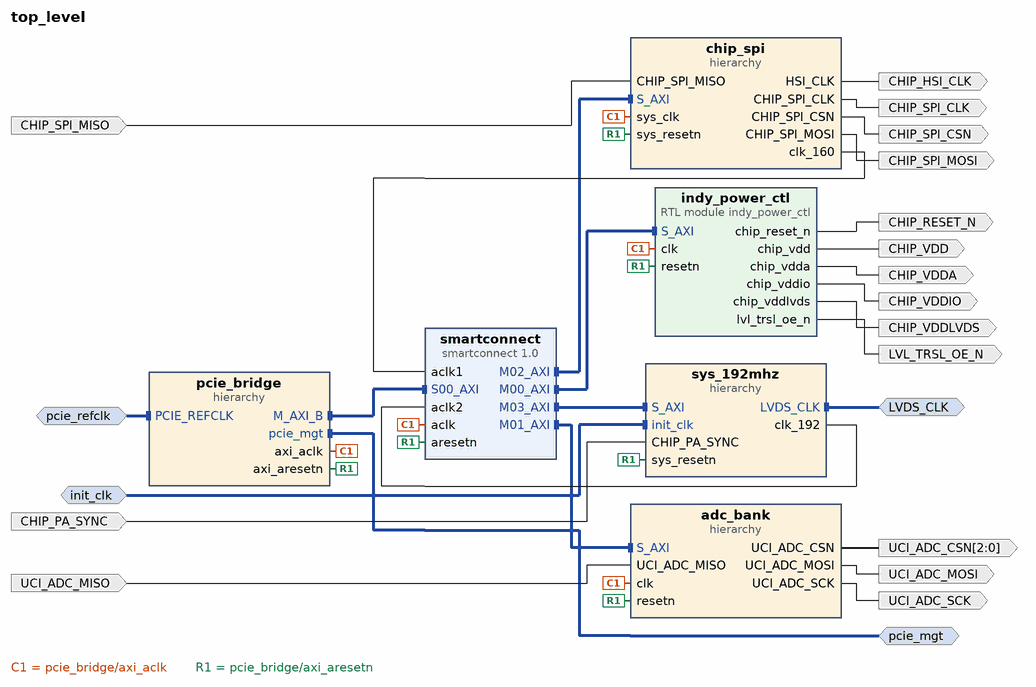
[diagram p0: block diagram of the top level]
# Vivado block design top_level, xcku15p-ffve1517-3-e, Vivado 2024.2
create_bd_design top_level

create_bd_intf_port -mode Slave -vlnv xilinx.com:interface:diff_clock_rtl:1.0 pcie_refclk
create_bd_intf_port -mode Master -vlnv xilinx.com:interface:pcie_7x_mgt_rtl:1.0 pcie_mgt
create_bd_intf_port -mode Slave -vlnv xilinx.com:interface:diff_clock_rtl:1.0 init_clk
set_property -dict {CONFIG.FREQ_HZ 200000000} [get_bd_intf_ports init_clk]
create_bd_intf_port -mode Master -vlnv xilinx.com:interface:diff_clock_rtl:1.0 LVDS_CLK
create_bd_port -dir O CHIP_SPI_CLK
create_bd_port -dir O CHIP_SPI_CSN
create_bd_port -dir O CHIP_SPI_MOSI
create_bd_port -dir I CHIP_SPI_MISO
create_bd_port -dir O CHIP_VDDIO
create_bd_port -dir O CHIP_VDD
create_bd_port -dir O CHIP_VDDLVDS
create_bd_port -dir O CHIP_VDDA
create_bd_port -dir O CHIP_RESET_N
create_bd_port -dir O -from 2 -to 0 UCI_ADC_CSN
create_bd_port -dir O UCI_ADC_SCK
create_bd_port -dir O UCI_ADC_MOSI
create_bd_port -dir I UCI_ADC_MISO
create_bd_port -dir O LVL_TRSL_OE_N
create_bd_port -dir O CHIP_HSI_CLK
create_bd_port -dir I CHIP_PA_SYNC

create_bd_cell -type hier pcie_bridge
create_bd_cell -type ip -vlnv xilinx.com:ip:smartconnect:1.0 smartconnect
set_property -dict {CONFIG.NUM_CLKS 3 CONFIG.NUM_MI 4 CONFIG.NUM_SI 1} [get_bd_cells smartconnect]
create_bd_cell -type hier adc_bank
create_bd_cell -type hier chip_spi
create_bd_cell -type module -reference indy_power_ctl indy_power_ctl
create_bd_cell -type hier sys_192mhz

# ---- hierarchy /pcie_bridge ----
current_bd_instance /pcie_bridge
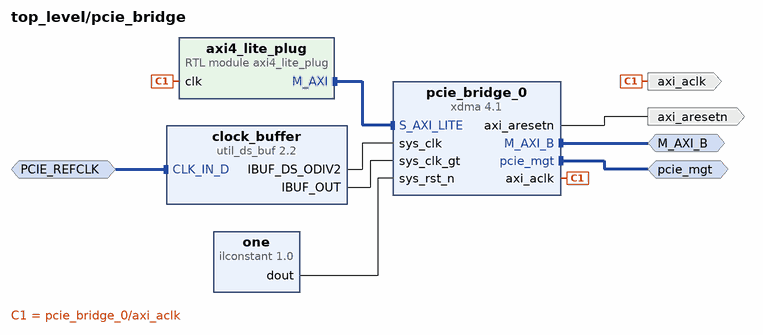
[diagram p1: block diagram inside /pcie_bridge]
create_bd_intf_pin -mode Slave -vlnv xilinx.com:interface:diff_clock_rtl:1.0 PCIE_REFCLK
create_bd_intf_pin -mode Master -vlnv xilinx.com:interface:pcie_7x_mgt_rtl:1.0 pcie_mgt
create_bd_intf_pin -mode Master -vlnv xilinx.com:interface:aximm_rtl:1.0 M_AXI_B
create_bd_pin -dir O -type clk axi_aclk
create_bd_pin -dir O -type rst axi_aresetn

create_bd_cell -type ip -vlnv xilinx.com:ip:util_ds_buf:2.2 clock_buffer
set_property -dict {CONFIG.C_BUF_TYPE IBUFDSGTE} [get_bd_cells clock_buffer]
create_bd_cell -type module -reference axi4_lite_plug axi4_lite_plug
create_bd_cell -type ip -vlnv xilinx.com:ip:xdma:4.1 pcie_bridge_0
set_property -dict [list \
  CONFIG.PF0_DEVICE_ID_mqdma 903F \
  CONFIG.PF0_SRIOV_VF_DEVICE_ID A03F \
  CONFIG.PF2_DEVICE_ID_mqdma 923F \
  CONFIG.PF3_DEVICE_ID_mqdma 933F \
  CONFIG.axi_addr_width 64 \
  CONFIG.axi_data_width 512_bit \
  CONFIG.axisten_freq 250 \
  CONFIG.bridge_burst true \
  CONFIG.en_axi_slave_if false \
  CONFIG.en_gt_selection false \
  CONFIG.functional_mode AXI_Bridge \
  CONFIG.mode_selection Advanced \
  CONFIG.pcie_blk_locn X0Y3 \
  CONFIG.pf0_bar0_scale Megabytes \
  CONFIG.pf0_bar0_size 1 \
  CONFIG.pf0_device_id 903F \
  CONFIG.pf0_msi_enabled false \
  CONFIG.pl_link_cap_max_link_speed 8.0_GT/s \
  CONFIG.pl_link_cap_max_link_width X16 \
  CONFIG.runbit_fix false \
  CONFIG.xlnx_ref_board None \
] [get_bd_cells pcie_bridge_0]
create_bd_cell -type inline_hdl -vlnv xilinx.com:inline_hdl:ilconstant:1.0 one

# ---- hierarchy /adc_bank ----
current_bd_instance /adc_bank
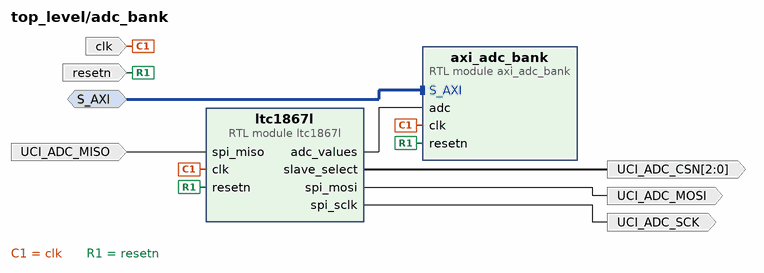
[diagram p2: block diagram inside /adc_bank]
create_bd_intf_pin -mode Slave -vlnv xilinx.com:interface:aximm_rtl:1.0 S_AXI
create_bd_pin -dir I -type clk clk
create_bd_pin -dir I -type rst resetn
create_bd_pin -dir O -from 2 -to 0 UCI_ADC_CSN
create_bd_pin -dir O UCI_ADC_SCK
create_bd_pin -dir O UCI_ADC_MOSI
create_bd_pin -dir I UCI_ADC_MISO

create_bd_cell -type module -reference axi_adc_bank axi_adc_bank
set_property -dict {CONFIG.ADC_COUNT 3} [get_bd_cells axi_adc_bank]
create_bd_cell -type module -reference ltc1867l ltc1867l
set_property -dict {CONFIG.ADC_COUNT 3} [get_bd_cells ltc1867l]

# ---- hierarchy /chip_spi ----
current_bd_instance /chip_spi
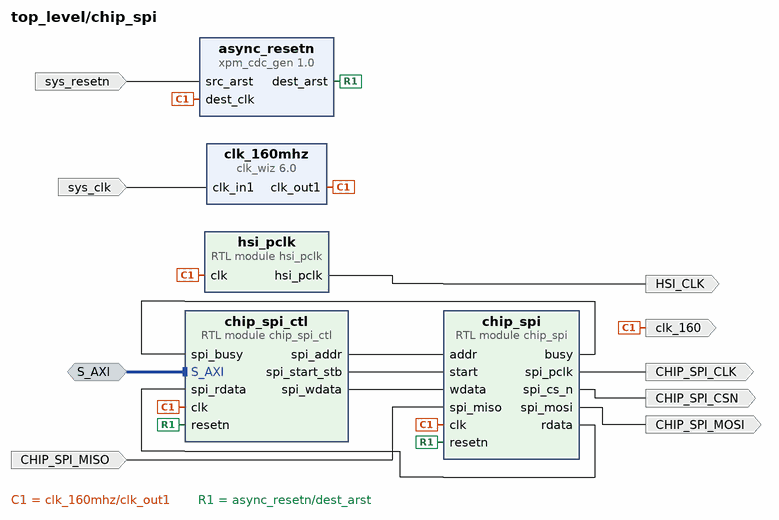
[diagram p3: block diagram inside /chip_spi]
create_bd_intf_pin -mode Slave -vlnv xilinx.com:interface:aximm_rtl:1.0 S_AXI
create_bd_pin -dir O CHIP_SPI_CLK
create_bd_pin -dir O CHIP_SPI_MOSI
create_bd_pin -dir I CHIP_SPI_MISO
create_bd_pin -dir O CHIP_SPI_CSN
create_bd_pin -dir O HSI_CLK
create_bd_pin -dir I sys_resetn
create_bd_pin -dir I -type clk sys_clk
create_bd_pin -dir O -type clk clk_160

create_bd_cell -type module -reference chip_spi chip_spi
create_bd_cell -type module -reference chip_spi_ctl chip_spi_ctl
create_bd_cell -type module -reference hsi_pclk hsi_pclk
create_bd_cell -type ip -vlnv xilinx.com:ip:clk_wiz:6.0 clk_160mhz
set_property -dict [list \
  CONFIG.CLKOUT1_JITTER 124.025 \
  CONFIG.CLKOUT1_REQUESTED_OUT_FREQ 160.00 \
  CONFIG.MMCM_CLKOUT0_DIVIDE_F 7.500 \
  CONFIG.USE_LOCKED false \
  CONFIG.USE_RESET false \
] [get_bd_cells clk_160mhz]
create_bd_cell -type ip -vlnv xilinx.com:ip:xpm_cdc_gen:1.0 async_resetn
set_property -dict {CONFIG.CDC_TYPE xpm_cdc_async_rst} [get_bd_cells async_resetn]

# ---- hierarchy /sys_192mhz ----
current_bd_instance /sys_192mhz
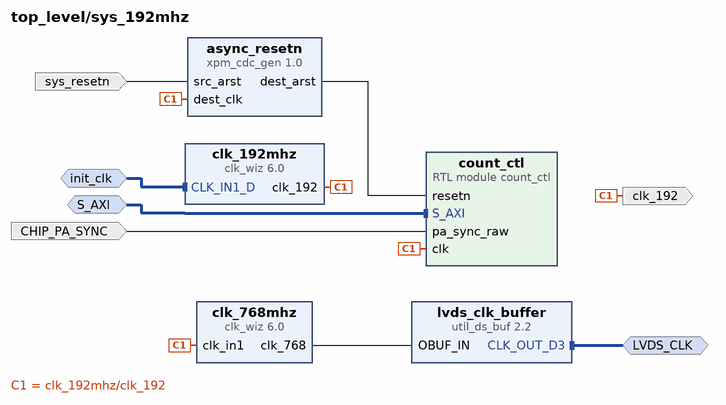
[diagram p4: block diagram inside /sys_192mhz]
create_bd_intf_pin -mode Slave -vlnv xilinx.com:interface:aximm_rtl:1.0 S_AXI
create_bd_intf_pin -mode Slave -vlnv xilinx.com:interface:diff_clock_rtl:1.0 init_clk
create_bd_intf_pin -mode Master -vlnv xilinx.com:interface:diff_clock_rtl:1.0 LVDS_CLK
create_bd_pin -dir I CHIP_PA_SYNC
create_bd_pin -dir I sys_resetn
create_bd_pin -dir O -type clk clk_192

create_bd_cell -type module -reference count_ctl count_ctl
create_bd_cell -type ip -vlnv xilinx.com:ip:clk_wiz:6.0 clk_768mhz
set_property -dict [list \
  CONFIG.CLKOUT1_DRIVES No_buffer \
  CONFIG.CLKOUT1_JITTER 64.075 \
  CONFIG.CLKOUT1_PHASE_ERROR 72.940 \
  CONFIG.CLKOUT1_REQUESTED_OUT_FREQ 768 \
  CONFIG.CLK_OUT1_PORT clk_768 \
  CONFIG.FEEDBACK_SOURCE FDBK_ONCHIP \
  CONFIG.MMCM_CLKFBOUT_MULT_F 8.000 \
  CONFIG.MMCM_CLKOUT0_DIVIDE_F 2.000 \
  CONFIG.PRIM_SOURCE Global_buffer \
  CONFIG.USE_LOCKED false \
  CONFIG.USE_RESET false \
] [get_bd_cells clk_768mhz]
create_bd_cell -type ip -vlnv xilinx.com:ip:clk_wiz:6.0 clk_192mhz
set_property -dict [list \
  CONFIG.CLKOUT1_JITTER 93.529 \
  CONFIG.CLKOUT1_REQUESTED_OUT_FREQ 192 \
  CONFIG.CLK_OUT1_PORT clk_192 \
  CONFIG.MMCM_CLKOUT0_DIVIDE_F 6.250 \
  CONFIG.PRIM_SOURCE Differential_clock_capable_pin \
  CONFIG.USE_LOCKED false \
  CONFIG.USE_RESET false \
] [get_bd_cells clk_192mhz]
create_bd_cell -type ip -vlnv xilinx.com:ip:util_ds_buf:2.2 lvds_clk_buffer
set_property -dict {CONFIG.C_BUF_TYPE OBUFDS} [get_bd_cells lvds_clk_buffer]
create_bd_cell -type ip -vlnv xilinx.com:ip:xpm_cdc_gen:1.0 async_resetn
set_property -dict {CONFIG.CDC_TYPE xpm_cdc_async_rst} [get_bd_cells async_resetn]

# ---- connections ----

current_bd_instance /pcie_bridge
connect_bd_intf_net -intf_net CLK_IN_D_0_1 [get_bd_intf_pins PCIE_REFCLK] [get_bd_intf_pins clock_buffer/CLK_IN_D]
connect_bd_intf_net [get_bd_intf_pins pcie_bridge_0/pcie_mgt] [get_bd_intf_pins pcie_mgt]
connect_bd_intf_net [get_bd_intf_pins pcie_bridge_0/M_AXI_B] [get_bd_intf_pins M_AXI_B]
connect_bd_intf_net [get_bd_intf_pins axi4_lite_plug/M_AXI] [get_bd_intf_pins pcie_bridge_0/S_AXI_LITE]
connect_bd_net [get_bd_pins clock_buffer/IBUF_DS_ODIV2] [get_bd_pins pcie_bridge_0/sys_clk]
connect_bd_net [get_bd_pins clock_buffer/IBUF_OUT] [get_bd_pins pcie_bridge_0/sys_clk_gt]
connect_bd_net [get_bd_pins one/dout] [get_bd_pins pcie_bridge_0/sys_rst_n]
connect_bd_net [get_bd_pins pcie_bridge_0/axi_aclk] [get_bd_pins axi_aclk] [get_bd_pins axi4_lite_plug/clk]
connect_bd_net [get_bd_pins pcie_bridge_0/axi_aresetn] [get_bd_pins axi_aresetn]

current_bd_instance /adc_bank
connect_bd_intf_net -intf_net smartconnect_M04_AXI [get_bd_intf_pins S_AXI] [get_bd_intf_pins axi_adc_bank/S_AXI]
connect_bd_net [get_bd_pins UCI_ADC_MISO] [get_bd_pins ltc1867l/spi_miso]
connect_bd_net [get_bd_pins ltc1867l/adc_values] [get_bd_pins axi_adc_bank/adc]
connect_bd_net [get_bd_pins ltc1867l/slave_select] [get_bd_pins UCI_ADC_CSN]
connect_bd_net [get_bd_pins ltc1867l/spi_mosi] [get_bd_pins UCI_ADC_MOSI]
connect_bd_net [get_bd_pins ltc1867l/spi_sclk] [get_bd_pins UCI_ADC_SCK]
connect_bd_net -net pcie_bridge_0_axi_aclk [get_bd_pins clk] [get_bd_pins ltc1867l/clk] [get_bd_pins axi_adc_bank/clk]
connect_bd_net -net pcie_bridge_0_axi_aresetn [get_bd_pins resetn] [get_bd_pins ltc1867l/resetn] [get_bd_pins axi_adc_bank/resetn]

current_bd_instance /chip_spi
connect_bd_intf_net [get_bd_intf_pins S_AXI] [get_bd_intf_pins chip_spi_ctl/S_AXI]
connect_bd_net [get_bd_pins CHIP_SPI_MISO] [get_bd_pins chip_spi/spi_miso]
connect_bd_net [get_bd_pins chip_spi/busy] [get_bd_pins chip_spi_ctl/spi_busy]
connect_bd_net [get_bd_pins chip_spi_ctl/spi_addr] [get_bd_pins chip_spi/addr]
connect_bd_net [get_bd_pins chip_spi_ctl/spi_start_stb] [get_bd_pins chip_spi/start]
connect_bd_net [get_bd_pins chip_spi_ctl/spi_wdata] [get_bd_pins chip_spi/wdata]
connect_bd_net [get_bd_pins chip_spi/rdata] [get_bd_pins chip_spi_ctl/spi_rdata]
connect_bd_net [get_bd_pins chip_spi/spi_cs_n] [get_bd_pins CHIP_SPI_CSN]
connect_bd_net [get_bd_pins chip_spi/spi_mosi] [get_bd_pins CHIP_SPI_MOSI]
connect_bd_net [get_bd_pins chip_spi/spi_pclk] [get_bd_pins CHIP_SPI_CLK]
connect_bd_net -net clk_1 [get_bd_pins clk_160mhz/clk_out1] \
  [get_bd_pins hsi_pclk/clk] [get_bd_pins chip_spi/clk] [get_bd_pins chip_spi_ctl/clk] [get_bd_pins clk_160] \
  [get_bd_pins async_resetn/dest_clk]
connect_bd_net [get_bd_pins hsi_pclk/hsi_pclk] [get_bd_pins HSI_CLK]
connect_bd_net -net resetn_1 [get_bd_pins async_resetn/dest_arst] [get_bd_pins chip_spi/resetn] [get_bd_pins chip_spi_ctl/resetn]
connect_bd_net [get_bd_pins sys_clk] [get_bd_pins clk_160mhz/clk_in1]
connect_bd_net [get_bd_pins sys_resetn] [get_bd_pins async_resetn/src_arst]

current_bd_instance /sys_192mhz
connect_bd_intf_net [get_bd_intf_pins clk_192mhz/CLK_IN1_D] [get_bd_intf_pins init_clk]
connect_bd_intf_net [get_bd_intf_pins lvds_clk_buffer/CLK_OUT_D3] [get_bd_intf_pins LVDS_CLK]
connect_bd_intf_net -intf_net smartconnect_M03_AXI [get_bd_intf_pins S_AXI] [get_bd_intf_pins count_ctl/S_AXI]
connect_bd_net [get_bd_pins CHIP_PA_SYNC] [get_bd_pins count_ctl/pa_sync_raw]
connect_bd_net -net chip_clocking_clk_192 [get_bd_pins clk_192mhz/clk_192] \
  [get_bd_pins clk_192] [get_bd_pins clk_768mhz/clk_in1] [get_bd_pins async_resetn/dest_clk] [get_bd_pins count_ctl/clk]
connect_bd_net -net chip_clocking_resetn_192 [get_bd_pins async_resetn/dest_arst] [get_bd_pins count_ctl/resetn]
connect_bd_net [get_bd_pins clk_768mhz/clk_768] [get_bd_pins lvds_clk_buffer/OBUF_IN]
connect_bd_net [get_bd_pins sys_resetn] [get_bd_pins async_resetn/src_arst]

current_bd_instance /
connect_bd_intf_net -intf_net CLK_IN_D_0_1 [get_bd_intf_ports pcie_refclk] [get_bd_intf_pins pcie_bridge/PCIE_REFCLK]
connect_bd_intf_net [get_bd_intf_pins chip_spi/S_AXI] [get_bd_intf_pins smartconnect/M02_AXI]
connect_bd_intf_net [get_bd_intf_pins adc_bank/S_AXI] [get_bd_intf_pins smartconnect/M01_AXI]
connect_bd_intf_net -intf_net hier_0_LVDS_CLK [get_bd_intf_ports LVDS_CLK] [get_bd_intf_pins sys_192mhz/LVDS_CLK]
connect_bd_intf_net [get_bd_intf_ports init_clk] [get_bd_intf_pins sys_192mhz/init_clk]
connect_bd_intf_net [get_bd_intf_pins smartconnect/S00_AXI] [get_bd_intf_pins pcie_bridge/M_AXI_B]
connect_bd_intf_net [get_bd_intf_ports pcie_mgt] [get_bd_intf_pins pcie_bridge/pcie_mgt]
connect_bd_intf_net [get_bd_intf_pins smartconnect/M00_AXI] [get_bd_intf_pins indy_power_ctl/S_AXI]
connect_bd_intf_net [get_bd_intf_pins sys_192mhz/S_AXI] [get_bd_intf_pins smartconnect/M03_AXI]
connect_bd_net [get_bd_ports CHIP_PA_SYNC] [get_bd_pins sys_192mhz/CHIP_PA_SYNC]
connect_bd_net [get_bd_ports CHIP_SPI_MISO] [get_bd_pins chip_spi/CHIP_SPI_MISO]
connect_bd_net [get_bd_ports UCI_ADC_MISO] [get_bd_pins adc_bank/UCI_ADC_MISO]
connect_bd_net [get_bd_pins chip_spi/HSI_CLK] [get_bd_ports CHIP_HSI_CLK]
connect_bd_net -net chip_spi_spi_cs_n [get_bd_pins chip_spi/CHIP_SPI_CSN] [get_bd_ports CHIP_SPI_CSN]
connect_bd_net -net chip_spi_spi_mosi [get_bd_pins chip_spi/CHIP_SPI_MOSI] [get_bd_ports CHIP_SPI_MOSI]
connect_bd_net -net chip_spi_spi_pclk [get_bd_pins chip_spi/CHIP_SPI_CLK] [get_bd_ports CHIP_SPI_CLK]
connect_bd_net -net clk_192mhz_clk_192 [get_bd_pins sys_192mhz/clk_192] [get_bd_pins smartconnect/aclk2]
connect_bd_net [get_bd_pins indy_power_ctl/chip_reset_n] [get_bd_ports CHIP_RESET_N]
connect_bd_net [get_bd_pins indy_power_ctl/chip_vdd] [get_bd_ports CHIP_VDD]
connect_bd_net [get_bd_pins indy_power_ctl/chip_vdda] [get_bd_ports CHIP_VDDA]
connect_bd_net [get_bd_pins indy_power_ctl/chip_vddio] [get_bd_ports CHIP_VDDIO]
connect_bd_net [get_bd_pins indy_power_ctl/chip_vddlvds] [get_bd_ports CHIP_VDDLVDS]
connect_bd_net [get_bd_pins indy_power_ctl/lvl_trsl_oe_n] [get_bd_ports LVL_TRSL_OE_N]
connect_bd_net -net ltc1867l_slave_select [get_bd_pins adc_bank/UCI_ADC_CSN] [get_bd_ports UCI_ADC_CSN]
connect_bd_net -net ltc1867l_spi_mosi [get_bd_pins adc_bank/UCI_ADC_MOSI] [get_bd_ports UCI_ADC_MOSI]
connect_bd_net -net ltc1867l_spi_sclk [get_bd_pins adc_bank/UCI_ADC_SCK] [get_bd_ports UCI_ADC_SCK]
connect_bd_net -net pcie_bridge_0_axi_aclk [get_bd_pins pcie_bridge/axi_aclk] \
  [get_bd_pins smartconnect/aclk] [get_bd_pins adc_bank/clk] [get_bd_pins indy_power_ctl/clk] [get_bd_pins chip_spi/sys_clk]
connect_bd_net -net pcie_bridge_0_axi_aresetn [get_bd_pins pcie_bridge/axi_aresetn] \
  [get_bd_pins smartconnect/aresetn] [get_bd_pins adc_bank/resetn] [get_bd_pins indy_power_ctl/resetn] \
  [get_bd_pins sys_192mhz/sys_resetn] [get_bd_pins chip_spi/sys_resetn]
connect_bd_net -net source_160mhz_clk_out [get_bd_pins chip_spi/clk_160] [get_bd_pins smartconnect/aclk1]

# ---- address map ----
assign_bd_address -offset 0x00000000 -range 512M -target_address_space [get_bd_addr_spaces pcie_bridge/axi4_lite_plug/M_AXI] [get_bd_addr_segs pcie_bridge/pcie_bridge_0/S_AXI_LITE/CTL0]
assign_bd_address -offset 0x0000000000001000 -range 4K -target_address_space [get_bd_addr_spaces pcie_bridge/pcie_bridge_0/M_AXI_B] [get_bd_addr_segs chip_spi/chip_spi_ctl/S_AXI/reg0]
assign_bd_address -offset 0x0000000000002000 -range 4K -target_address_space [get_bd_addr_spaces pcie_bridge/pcie_bridge_0/M_AXI_B] [get_bd_addr_segs sys_192mhz/count_ctl/S_AXI/reg0]
assign_bd_address -offset 0x0000000000004000 -range 256 -target_address_space [get_bd_addr_spaces pcie_bridge/pcie_bridge_0/M_AXI_B] [get_bd_addr_segs indy_power_ctl/S_AXI/reg0]
assign_bd_address -offset 0x0000000000005000 -range 256 -target_address_space [get_bd_addr_spaces pcie_bridge/pcie_bridge_0/M_AXI_B] [get_bd_addr_segs adc_bank/axi_adc_bank/S_AXI/reg0]

validate_bd_design
save_bd_design
